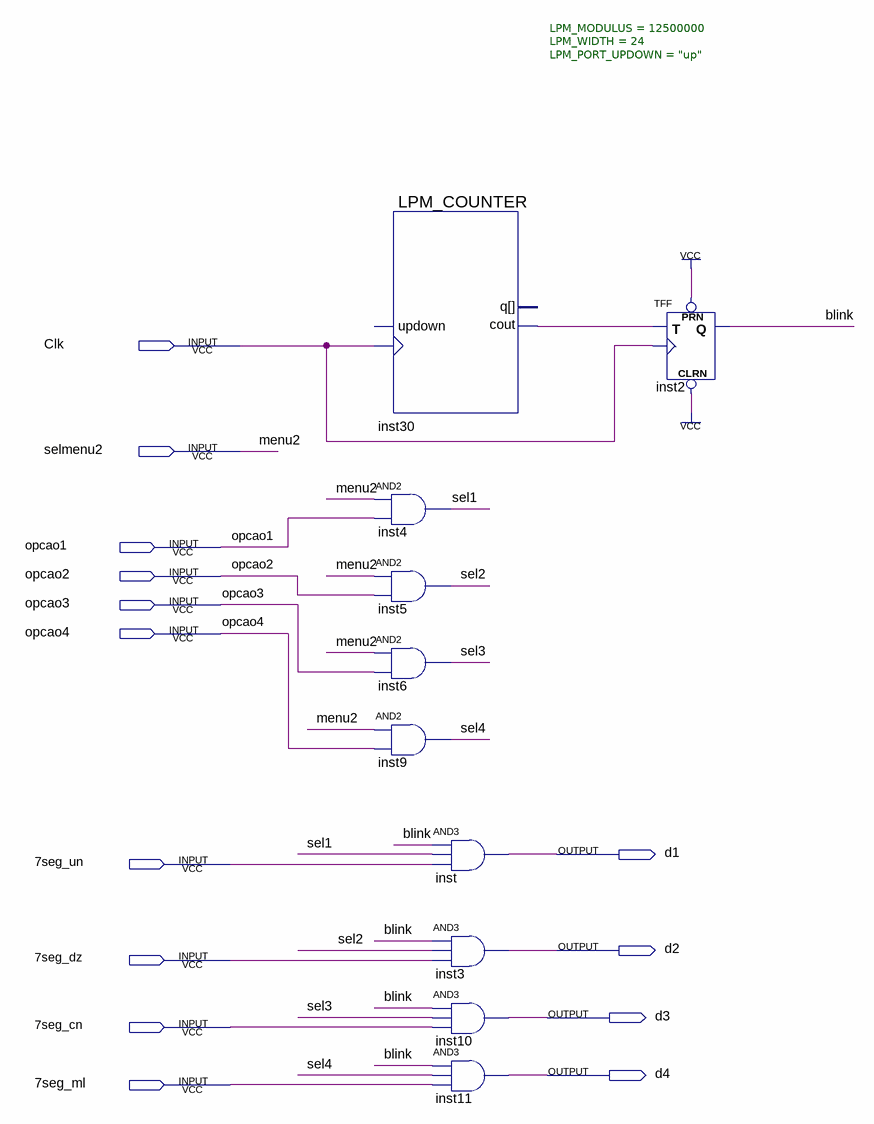
[diagram p0: schematic sheet]
// Quartus schematic Blink_dig.bdf as structural Verilog: 10 symbols, 14 pins
module Blink_dig (
  input  Clk,
  input  selmenu2,
  input  opcao1,
  input  opcao2,
  input  opcao3,
  input  opcao4,
  input  \7seg_un ,
  input  \7seg_dz ,
  input  \7seg_cn ,
  input  \7seg_ml ,
  output d1,
  output d2,
  output d3,
  output d4
);

  wire blink, inst30_cout, sel1, sel2, sel3, sel4;

  LPM_COUNTER #(.LPM_MODULUS(12500000), .LPM_WIDTH(24), .LPM_PORT_UPDOWN("up")) inst30 (
    .clock(Clk), .cout(inst30_cout));  // open: updown, q
  and inst4 (sel1, selmenu2, opcao1);
  and inst5 (sel2, selmenu2, opcao2);
  and inst6 (sel3, selmenu2, opcao3);
  and inst9 (sel4, selmenu2, opcao4);
  and inst (d1, blink, sel1, \7seg_un );
  and inst3 (d2, blink, sel2, \7seg_dz );
  and inst10 (d3, blink, sel3, \7seg_cn );
  and inst11 (d4, blink, sel4, \7seg_ml );
  TFF inst2 (.PRN(1'b1), .CLRN(1'b1), .T(inst30_cout), .CLK(Clk), .Q(blink));

  // Other names for the same wires on the sheet: menu2 = selmenu2
endmodule
